# EAGLE design relay board (EAGLE 8.2.2)
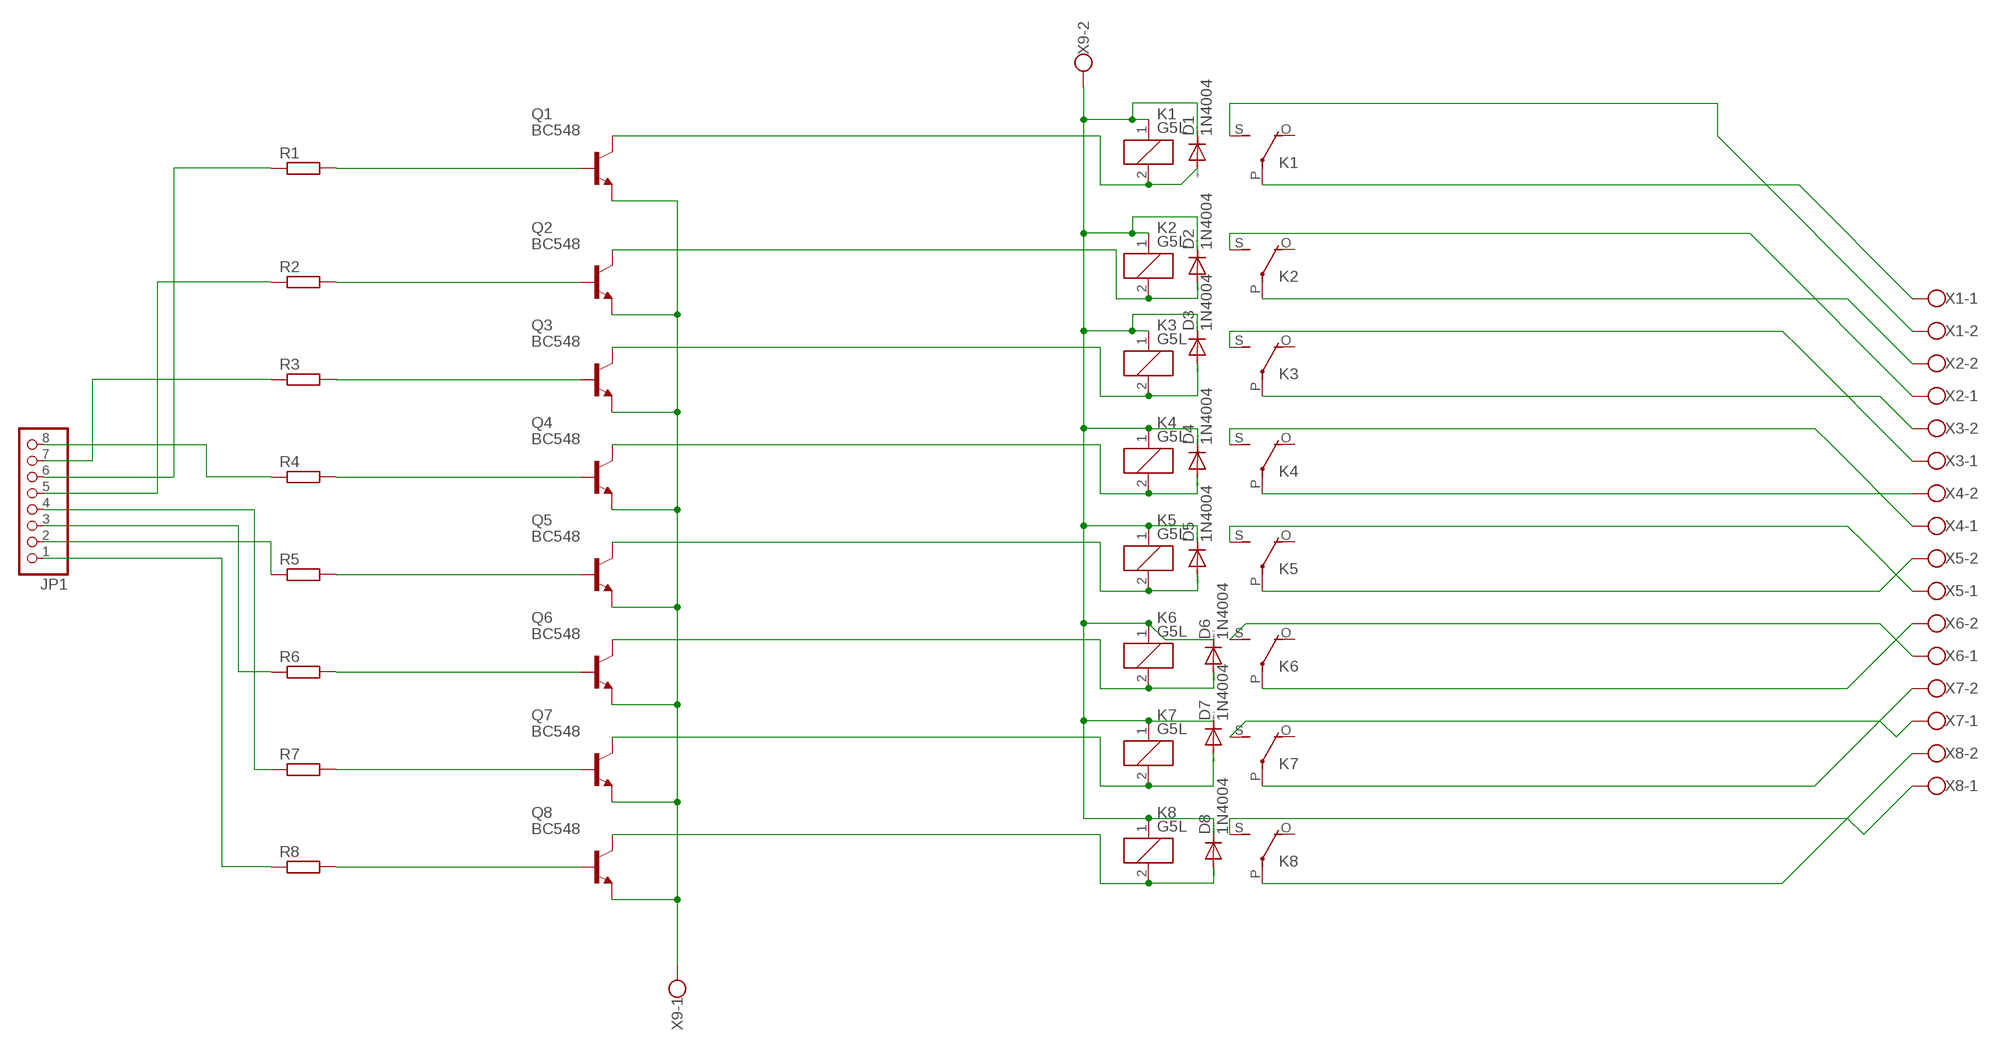
[diagram p0: schematic, sheet 1]

## Parts
D1  1N4004  [DO41-10]
D2  1N4004  [DO41-10]
D3  1N4004  [DO41-10]
D4  1N4004  [DO41-10]
D5  1N4004  [DO41-10]
D6  1N4004  [DO41-10]
D7  1N4004  [DO41-10]
D8  1N4004  [DO41-10]
JP1  PINHD-1X8  [1X08]
K1  G5L  [G5LE]
K2  G5L  [G5LE]
K3  G5L  [G5LE]
K4  G5L  [G5LE]
K5  G5L  [G5LE]
K6  G5L  [G5LE]
K7  G5L  [G5LE]
K8  G5L  [G5LE]
Q1  BC548  [TO92-EBC]
Q2  BC548  [TO92-EBC]
Q3  BC548  [TO92-EBC]
Q4  BC548  [TO92-EBC]
Q5  BC548  [TO92-EBC]
Q6  BC548  [TO92-EBC]
Q7  BC548  [TO92-EBC]
Q8  BC548  [TO92-EBC]
R1  RCL_R-EU_0207/10  [RCL_0207/10]
R2  RCL_R-EU_0207/10  [RCL_0207/10]
R3  RCL_R-EU_0207/10  [RCL_0207/10]
R4  RCL_R-EU_0207/10  [RCL_0207/10]
R5  RCL_R-EU_0207/10  [RCL_0207/10]
R6  RCL_R-EU_0207/10  [RCL_0207/10]
R7  RCL_R-EU_0207/10  [RCL_0207/10]
R8  RCL_R-EU_0207/10  [RCL_0207/10]
X1  W237-102  [W237-102]
X2  W237-102  [W237-102]
X3  W237-102  [W237-102]
X4  W237-102  [W237-102]
X5  W237-102  [W237-102]
X6  W237-102  [W237-102]
X7  W237-102  [W237-102]
X8  W237-102  [W237-102]
X9  W237-102  [W237-102]

## Nets
12V: D1.C D2.C D3.C D4.C D5.C D6.C D7.C D8.C K1.1 K2.1 K3.1 K4.1 K5.1 K6.1 K7.1 K8.1 X9.2
GND: Q1.E Q2.E Q3.E Q4.E Q5.E Q6.E Q7.E Q8.E X9.1
N$1: JP1.2 R5.1
N$2: D1.A K1.2 Q1.C
N$3: D2.A K2.2 Q2.C
N$4: D3.A K3.2 Q3.C
N$5: D4.A K4.2 Q4.C
N$6: D5.A K5.2 Q5.C
N$7: D6.A K6.2 Q6.C
N$8: D7.A K7.2 Q7.C
N$9: D8.A K8.2 Q8.C
N$10: K1.P(2:P) X1.1
N$11: K2.P(2:P) X2.2
N$12: K3.P(2:P) X3.2
N$13: K4.P(2:P) X4.2
N$14: K5.P(2:P) X5.2
N$15: K6.P(2:P) X6.2
N$16: K7.P(2:P) X7.2
N$17: Q1.B R1.2
N$18: Q2.B R2.2
N$19: Q3.B R3.2
N$20: Q4.B R4.2
N$21: Q5.B R5.2
N$22: Q6.B R6.2
N$23: Q7.B R7.2
N$24: Q8.B R8.2
N$25: JP1.5 R2.1
N$26: JP1.6 R1.1
N$27: JP1.7 R3.1
N$28: JP1.8 R4.1
N$30: JP1.4 R7.1
N$31: JP1.3 R6.1
N$32: JP1.1 R8.1
N$33: K8.P(2:P) X8.2
N$34: K1.S(2:S) X1.2
N$35: K2.S(2:S) X2.1
N$36: K3.S(2:S) X3.1
N$37: K4.S(2:S) X4.1
N$38: K5.S(2:S) X5.1
N$40: K7.S(2:S) X7.1
N$41: K8.S(2:S) X8.1
N$46: K6.S(2:S) X6.1
Unconnected: K1.O(2:O) K2.O(2:O) K3.O(2:O) K4.O(2:O) K5.O(2:O) K6.O(2:O) K7.O(2:O) K8.O(2:O)

## Library data of the parts
D1-D8 = diode:1N4004: DIODE general purpose rectifier, 1 A
JP1 = pinhead:PINHD-1X8: PIN HEADER
K1-K8 = relay:G5L: RELAY 1 x switch, 10 A/120 V AC, 8 A/30 V ADC, Omron; OC_FARNELL: unknown; OC_NEWARK: unknown
Q1-Q8 = transistor-npn:BC548*: NPN Transistor
R1-R8 = roomautomationfinal:RCL_R-EU_: RESISTOR, European symbol
X1-X9 = con-wago-500:W237-102: WAGO SCREW CLAMP; MPN: 237-102; OC_FARNELL: unknown; OC_NEWARK: 70K9898

## Board
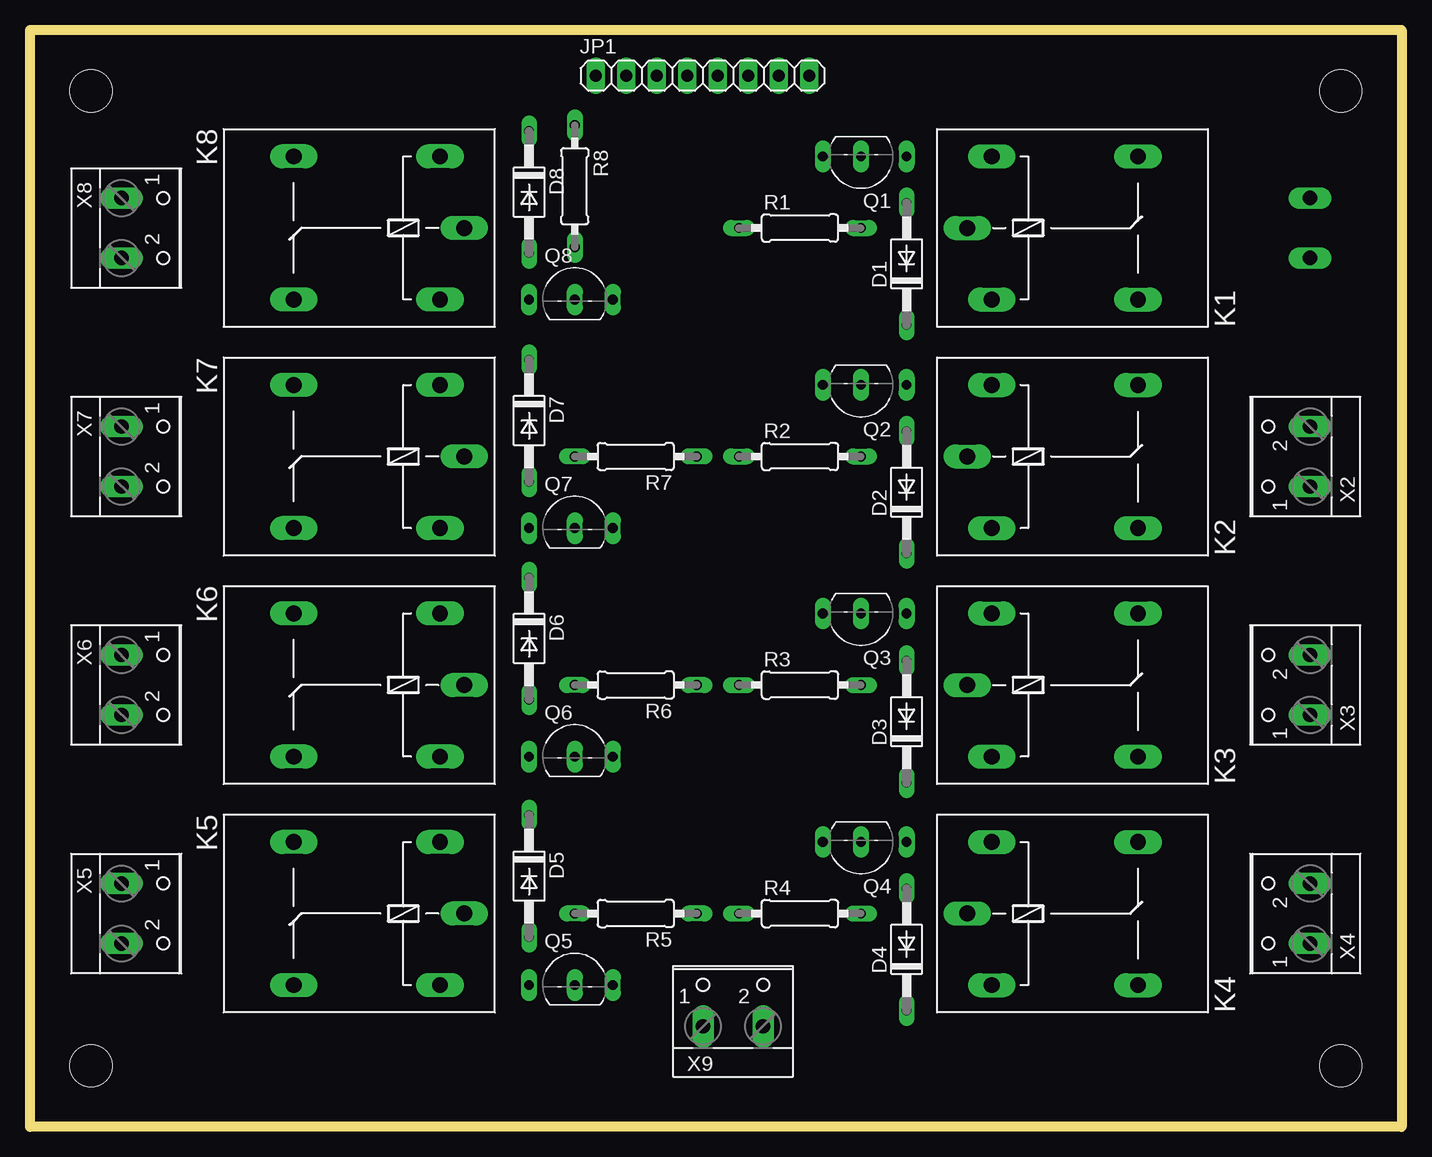
[diagram p1: board, top side]
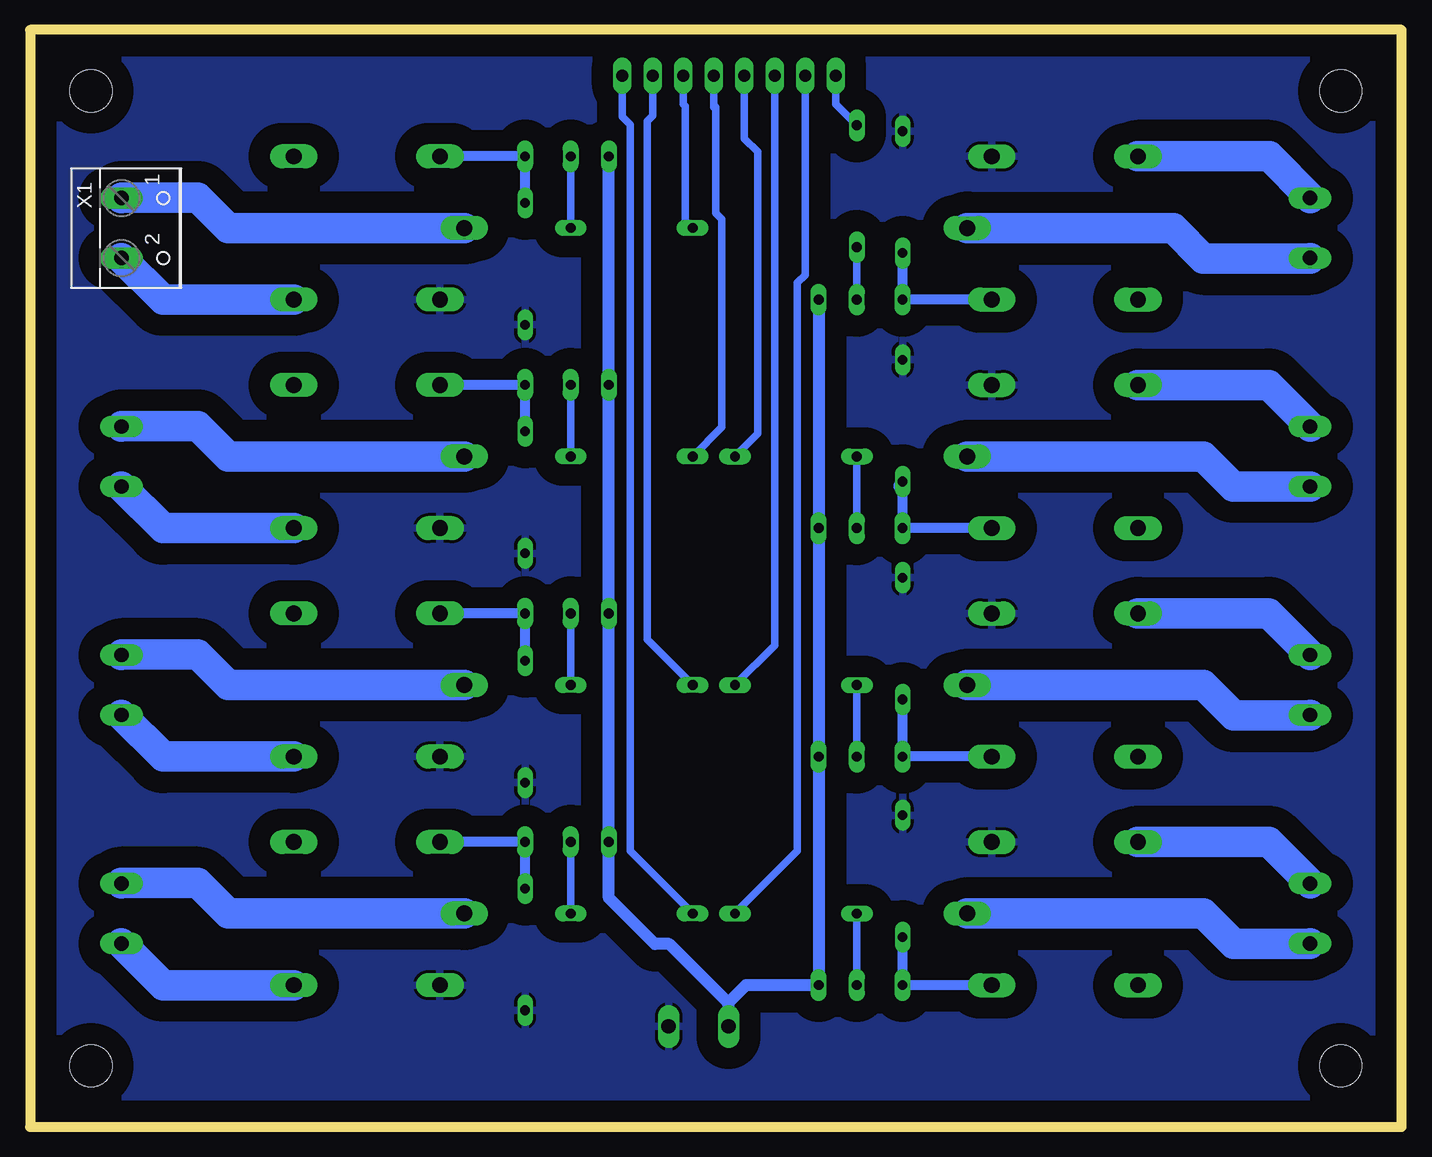
[diagram p2: board, bottom side, seen from below]

Size 114.3 x 91.44 mm. Coordinates in mm from the lower left corner, seen from the top.
Outline: 0,91.44 114.3,91.44 114.3,0 0,0 0,91.44
Copper layers (1*16): Top 0.035mm / dielectric 1.5mm / Bottom 0.035mm
Design rules "default *": minimum track width 6mil, minimum drill 0.35mm, track to track 32mil, track to pad 32mil, pad to pad 32mil, via to via 32mil, smd to smd 32mil, copper to edge 40mil, drill to drill 20mil, minimum pad ring 10mil, minimum via ring 8mil, stop-mask expansion 4mil, vias tented up to drill 0mil, thermal gap 10mil
Holes 3.5 mm at 5.08,86.36 109.22,86.36 109.22,5.08 5.08,5.08

### Footprints (pad centres in the part's own frame; a part is rotated, then mirrored left to right if it is on the bottom)
DO41-10 = drill 0.8 long: A 5.08,0; C -5.08,0
1X08 = drill 1.016 long: 1 -8.89,0; 2 -6.35,0; 3 -3.81,0; 4 -1.27,0; 5 1.27,0; 6 3.81,0; 7 6.35,0; 8 8.89,0
G5LE = drill 1.321 long: 1 -7.493,-5.969; 2 -7.493,5.969; O 4.699,5.969; P -9.525,0; S 4.699,-5.969
TO92-EBC = drill 0.813 long: B 0,-1.27; C -3.81,-1.27; E 3.175,-1.27
RCL_0207/10 = drill 0.813 long: 1 -5.08,0; 2 5.08,0
W237-102 = drill 1.194 long: 1 -2.5,-1.27; 2 2.5,-1.27

### Placement (x,y rotation side)
D1  73.05,71.94 90 top
D2  73.05,52.89 90 top
D3  73.05,33.78 90 top
D4  73.05,14.79 90 top
D5  41.59,20.9 270 top
D6  41.59,40.71 270 top
D7  41.59,58.87 270 top
D8  41.59,77.92 270 top
JP1  56.05,87.63 0 top
K1  87.63,74.93 0 top
K2  87.63,55.88 0 top
K3  87.63,36.83 0 top
K4  87.63,17.78 0 top
K5  26.67,17.78 180 top
K6  26.67,36.83 180 top
K7  26.67,55.88 180 top
K8  26.67,74.93 180 top
Q1  69.24,79.63 180 top
Q2  69.24,60.58 180 top
Q3  69.24,41.53 180 top
Q4  69.24,22.48 180 top
Q5  45.4,13.08 0 top
Q6  45.4,32.13 0 top
Q7  45.4,51.18 0 top
Q8  45.4,70.23 0 top
R1  64.16,74.93 0 top
R2  64.16,55.88 0 top
R3  64.16,36.83 0 top
R4  64.16,17.78 0 top
R5  50.48,17.78 180 top
R6  50.48,36.83 180 top
R7  50.48,55.88 180 top
R8  45.4,78.42 270 top
X1  105.41,74.93 270 bottom
X2  105.41,55.88 90 top
X3  105.41,36.83 90 top
X4  105.41,17.78 90 top
X5  8.89,17.78 270 top
X6  8.89,36.83 270 top
X7  8.89,55.88 270 top
X8  8.89,74.93 270 top
X9  58.58,9.64 0 top

### Tracks (layer width: path | path; a pad name or v marks a point on that pad's centre or on a via)
12V
  pour Bottom (isolate 1.778): 1.27,90.17 111.76,90.17 113.03,88.9 113.03,0 3.81,0 1.27,1.27
GND
  Bottom 1.016: Q8.E Q7.E Q6.E Q5.E 54.64,11.81 56.09,10.37 | Q1.E Q2.E Q3.E Q4.E 66.06,19.08 62.23,15.24 61.03,15.24 56.16,10.37 56.09,10.37 | X9.1 56.09,10.37
N$1
  Bottom 0.61: JP1.2 49.7,71.01 50.35,70.36 50.35,22.99 R5.1
N$2
  Bottom 0.813: K1.2 Q1.C D1.A
N$3
  Bottom 0.813: D2.A Q2.C K2.2
N$4
  Bottom 0.813: D3.A Q3.C K3.2
N$5
  Bottom 0.813: D4.A Q4.C K4.2
N$6
  Bottom 0.813: K5.2 Q5.C D5.A
N$7
  Bottom 0.813: K6.2 Q6.C D6.A
N$8
  Bottom 0.813: K7.2 Q7.C 41.59,53.02 41.91,53.34 41.91,53.47 D7.A
N$9
  Bottom 0.813: K8.2 Q8.C D8.A
N$10
  Bottom 2.54: K1.P 97.79,74.93 100.33,77.47 106.64,77.47 X1.1
N$11
  Bottom 2.54: K2.P 97.79,55.88 100.33,58.42 106.64,58.42 X2.2
N$12
  Bottom 2.54: K3.P 97.79,36.83 100.33,39.37 106.64,39.37 X3.2
N$13
  Bottom 2.54: K4.P 97.79,17.78 100.33,20.32 106.68,20.32 X4.2
N$14
  Bottom 2.54: K5.P 16.51,17.78 13.97,15.24 7.66,15.24 X5.2
N$15
  Bottom 2.54: K6.P 16.51,36.83 13.97,34.29 7.62,34.29 X6.2
N$16
  Bottom 2.54: X7.2 14.01,53.38 16.51,55.88 K7.P
N$17
  Bottom 0.61: Q1.B R1.2
N$18
  Bottom 0.61: R2.2 Q2.B
N$19
  Bottom 0.61: Q3.B R3.2
N$20
  Bottom 0.61: R4.2 Q4.B
N$21
  Bottom 0.61: R5.2 Q5.B
N$22
  Bottom 0.61: R6.2 Q6.B
N$23
  Bottom 0.61: R7.2 Q7.B
N$24
  Bottom 0.61: Q8.B R8.2
N$25
  Bottom 0.61: 57.15,84.83 57.15,76.18 56.64,75.67 56.64,58.32 R2.1 | 57.15,84.83 57.15,84.99 | JP1.5 57.32,84.99 57.15,84.83
N$26
  Bottom 0.61: R1.1 59.69,75.54 59.69,85.09 59.86,85.26 JP1.6
N$27
  Bottom 0.61: R3.1 62.86,40.62 62.86,83.82 62.4,84.29 JP1.7
N$28
  Bottom 0.61: R4.1 64.29,22.99 64.29,82.55 | 64.29,82.55 64.29,83.56 | 64.94,84.21 JP1.8 | 64.29,83.56 64.94,84.21 | 64.29,82.55 64.29,83.23 | 64.29,83.23 | 64.29,83.23 64.29,83.56 | 64.29,83.56 64.94,84.21
N$30
  Bottom 0.61: R7.1 53.66,57.78 53.66,81.28 54.78,82.4 JP1.4
N$31
  Bottom 0.61: JP1.3 52.24,40.15 R6.1
N$32
  Bottom 0.61: JP1.1 47.16,85.26 R8.1
N$33
  Bottom 2.54: K8.P 19.05,74.93 16.51,72.39 7.62,72.39 X8.2
N$34
  Bottom 2.54: K1.S 103.21,68.96 X1.2
N$35
  Bottom 2.54: K2.S 103.21,49.91 X2.1
N$36
  Bottom 2.54: K3.S 103.21,30.86 X3.1
N$37
  Bottom 2.54: K4.S 103.21,11.81 X4.1
N$38
  Bottom 2.54: K5.S 11.09,23.75 X5.1
N$40
  Bottom 2.54: K7.S 11.09,61.85 X7.1
N$41
  Bottom 2.54: X8.1 7.62,77.47 11.05,80.9 K8.S
N$46
  Bottom 2.54: K6.S 11.09,42.8 X6.1